# EAGLE design ring_indicator (EAGLE 6.6.0)
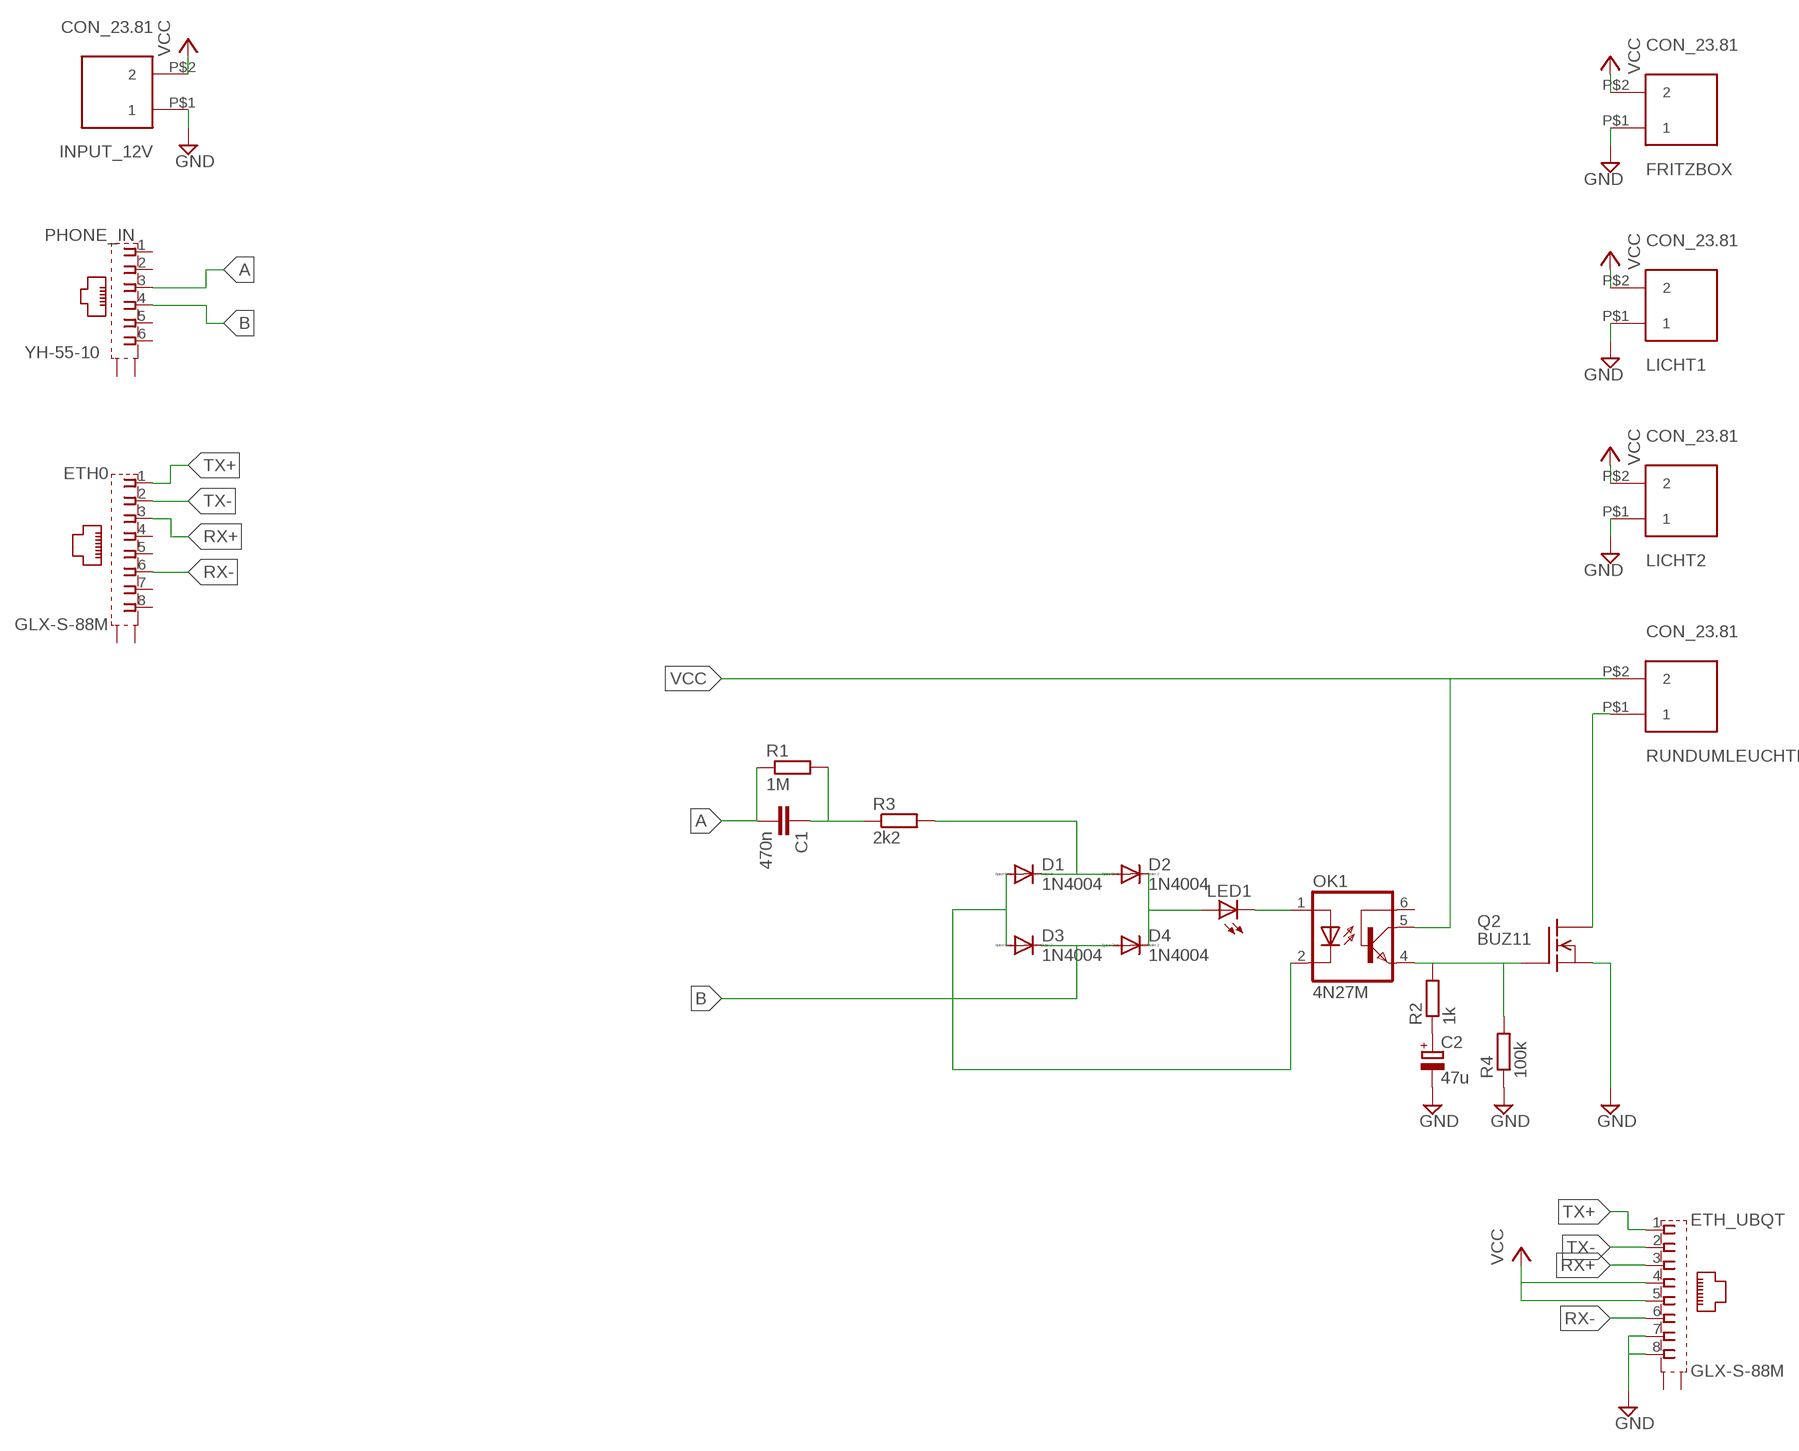
[diagram p0: schematic, sheet 1]

## Parts
C1  470n  C-EU102-064X133  [C102-064X133]
C2  47u  CPOL-EUE3.5-8  [E3,5-8]
D1  1N4004  [DO41-10]
D2  1N4004  [DO41-10]
D3  1N4004  [DO41-10]
D4  1N4004  [DO41-10]
ETH0  GLX-S-88M  [GLX-S-88M]
ETH_UBQT  GLX-S-88M  [GLX-S-88M]
FRITZBOX  CON_23.81  [CON_2_3.81]
INPUT_12V  CON_23.81  [CON_2_3.81]
LED1  LED5MM  [LED5MM]
LICHT1  CON_23.81  [CON_2_3.81]
LICHT2  CON_23.81  [CON_2_3.81]
OK1  4N27M  [DIL06]
PHONE_IN  YH-55-10  [YH-55-10]
Q2  BUZ11  [TO220]
R1  1M  R-EU_0207/10  [0207/10]
R2  1k  R-EU_0207/10  [0207/10]
R3  2k2  R-EU_0207/10  [0207/10]
R4  100k  R-EU_0207/10  [0207/10]
RUNDUMLEUCHTE  CON_23.81  [CON_2_3.81]

## Nets
A: C1.2 PHONE_IN.3 R1.1
B: D3.C D4.A PHONE_IN.4
GND: C2.- ETH_UBQT.7 ETH_UBQT.8 FRITZBOX.P$1 INPUT_12V.P$1 LICHT1.P$1 LICHT2.P$1 Q2.3(S) R4.1
N$1: C1.1 R1.2 R3.1
N$2: LED1.K(C) OK1.1(A)
N$3: D1.C D2.A R3.2
N$4: D2.C D4.C LED1.A
N$5: D1.A D3.A OK1.2(C)
N$6: Q2.2(D) RUNDUMLEUCHTE.P$1
N$9: OK1.4(EMI) Q2.1(G) R2.2 R4.2
N$10: C2.+ R2.1
RX+: ETH0.3 ETH_UBQT.3
RX-: ETH0.6 ETH_UBQT.6
TX+: ETH0.1 ETH_UBQT.1
TX-: ETH0.2 ETH_UBQT.2
VCC: ETH_UBQT.4 ETH_UBQT.5 FRITZBOX.P$2 INPUT_12V.P$2 LICHT1.P$2 LICHT2.P$2 OK1.5(COL) RUNDUMLEUCHTE.P$2
Unconnected: ETH0.4 ETH0.5 ETH0.7 ETH0.8 ETH0.S1 ETH0.S2 ETH_UBQT.S1 ETH_UBQT.S2 OK1.6(BAS) PHONE_IN.1 PHONE_IN.2 PHONE_IN.5 PHONE_IN.6 PHONE_IN.S1(S) PHONE_IN.S2(S)

## Library data of the parts
C1 = resistor:C-EU: CAPACITOR, European symbol
C2 = rcl:CPOL-EU: POLARIZED CAPACITOR, European symbol
D1-D4 = diode:1N4004: DIODE general purpose rectifier, 1 A
ETH0 ETH_UBQT = con-kycon:GLX-S-88M: Mod. Jack, Right Angle, 8 posiotion, 8 contatcs RJ45 Source: GLX-S-88M.pdf; OC_FARNELL: unknown; OC_NEWARK: unknown
FRITZBOX INPUT_12V LICHT1 LICHT2 RUNDUMLEUCHTE = pcaroli:CON_2
LED1 = led:LED: LED OSRAM: - CHIPLED LG R971, LG N971, LY N971, LG Q971, LY Q971, LO R971, LY R971 LH N974, LH R974 LS Q976, LO Q976, LY Q976 LO Q996 - Hyper CHIPLED LW Q18S LB Q993, LB Q99A, LB R99A - SideLED LS A670, LO A670, LY A670, LG A670, LP A670 LB A673, LV A673, LT A673, LW A673 LH A674 LY A675 LS A676, LA A676, LO A676, LY A676, LW A676 LS A679, LY A679, LG A679 - Hyper Micro SIDELED® LS Y876, LA Y876, LO Y876, LY Y876 LT Y87S - SmartLED LW L88C, LW L88S LB L89C, LB L89S, LG L890 LS L89K, LO L89K, LY L89K LS L896, LA L896, LO L896, LY L896 - TOPLED LS T670, LO T670, LY T670, LG T670, LP T670 LSG T670, LSP T670, LSY T670, LOP T670, LYG T670 LG T671, LOG T671, LSG T671 LB T673, LV T673, LT T673, LW T673 LH T674 LS T676, LA T676, LO T676, LY T676, LB T676, LH T676, LSB T676, LW T676 LB T67C, LV T67C, LT T67C, LS T67K, LO T67K, LY T67K, LW E67C LS E67B, LA E67B, LO E67B, LY E67B, LB E67C, LV E67C, LT E67C LW T67C LS T679, LY T679, LG T679 LS T770, LO T770, LY T770, LG T770, LP T770 LB T773, LV T773, LT T773, LW T773 LH T774 LS E675, LA E675, LY E675, LS T675 LS T776, LA T776, LO T776, LY T776, LB T776 LHGB T686 LT T68C, LB T68C - Hyper Mini TOPLED® LB M676 - Mini TOPLED Santana® LG M470 LS M47K, LO M47K, LY M47K Source: http://www.osram.convergy.de LUXEON: - LUMILED® LXK2-PW12-R00, LXK2-PW12-S00, LXK2-PW14-U00, LXK2-PW14-V00 LXK2-PM12-R00, LXK2-PM12-S00, LXK2-PM14-U00 LXK2-PE12-Q00, LXK2-PE12-R00, LXK2-PE12-S00, LXK2-PE14-T00, LXK2-PE14-U00 LXK2-PB12-K00, LXK2-PB12-L00, LXK2-PB12-M00, LXK2-PB14-N00, LXK2-PB14-P00, LXK2-PB14-Q00 LXK2-PR12-L00, LXK2-PR12-M00, LXK2-PR14-Q00, LXK2-PR14-R00 LXK2-PD12-Q00, LXK2-PD12-R00, LXK2-PD12-S00 LXK2-PH12-R00, LXK2-PH12-S00 LXK2-PL12-P00, LXK2-PL12-Q00, LXK2-PL12-R00 Source: www.luxeon.com KINGBRIGHT: KA-3528ASYC Source: www.kingbright.com
OK1 = optocoupler:4N*?M: General Purpose 6-Pin Phototransistor Optocouplers Source: http://www.fairchildsemi.com/ds/4N/4N35-M.pdf; MF: FAIRCHILD SEMICONDUCTOR; MPN: 4N27M; OC_FARNELL: unknown; OC_NEWARK: 72K9939
PHONE_IN = con-wenzhou-yihua:YH-55-10: RJ11 6 connects Source: YH-55-10.pdf; OC_FARNELL: unknown; OC_NEWARK: unknown
Q2 = transistor-fet:BUZ11: N-Channel Enhancement MOSFET 50V; 30A; 0,040Ohm
R1-R4 = rcl:R-EU_: RESISTOR, European symbol

## Board
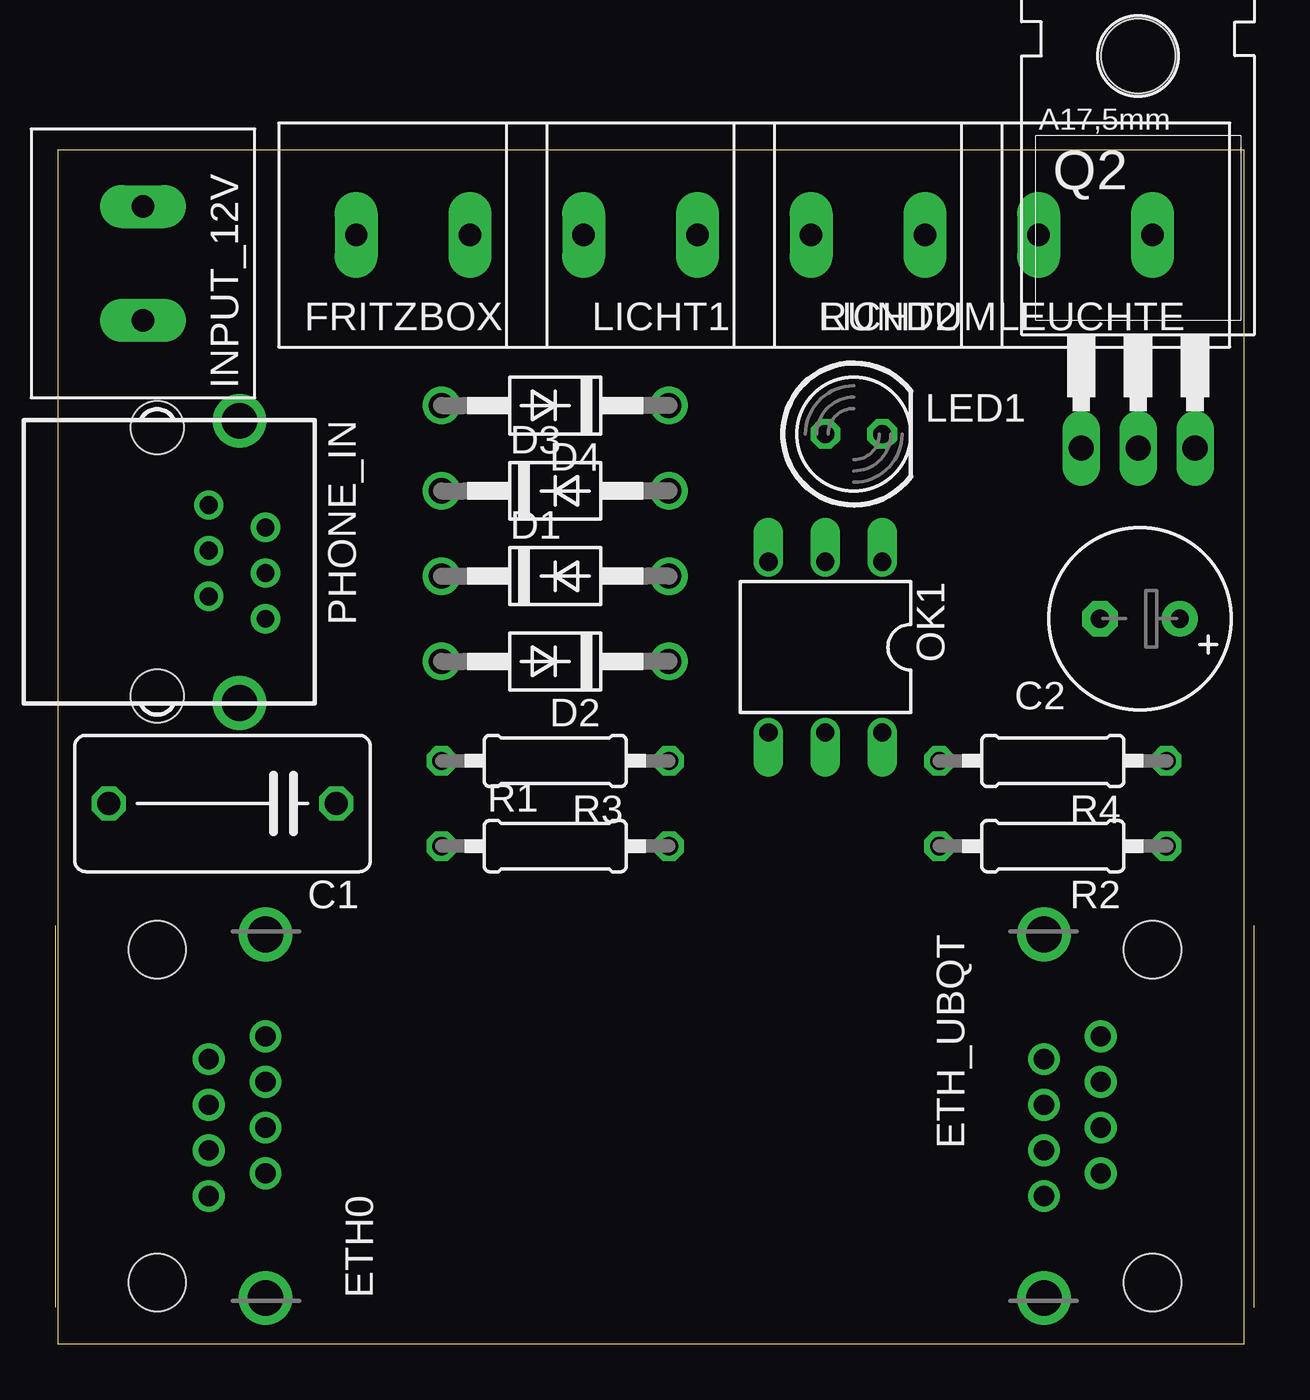
[diagram p1: board, top side]
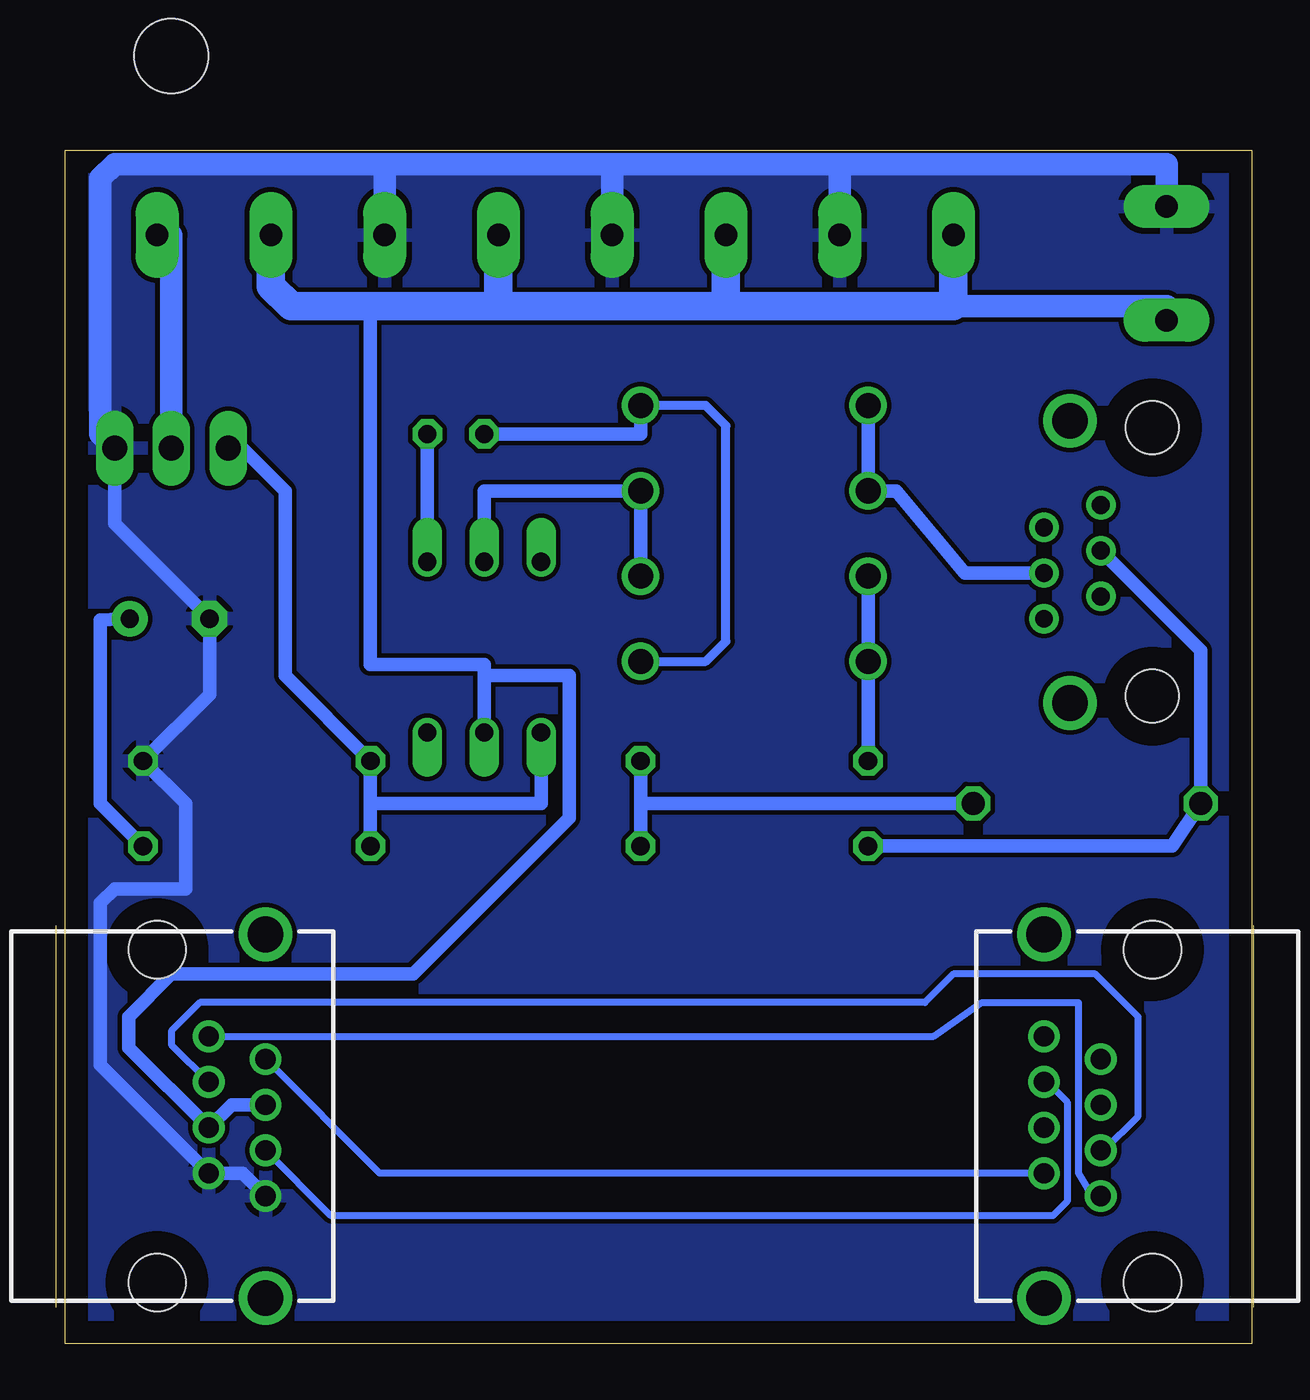
[diagram p2: board, bottom side, seen from below]

Size 53.01 x 53.33 mm. Coordinates in mm from the lower left corner, seen from the top.
Outline: 0,0 53.01,0 53.01,53.33 0,53.33 0,0
Copper layers (1*16): Top 0.035mm / dielectric 1.5mm / Bottom 0.035mm
Design rules "default": minimum track width 10mil, minimum drill 24mil, track to track 8mil, track to pad 8mil, pad to pad 8mil, via to via 8mil, smd to smd 8mil, copper to edge 40mil, drill to drill 8mil, minimum pad ring 10mil, minimum via ring 8mil, stop-mask expansion 4mil, vias tented up to drill 0mil, thermal gap 10mil

### Footprints (pad centres in the part's own frame; a part is rotated, then mirrored left to right if it is on the bottom)
C102-064X133 = drill 1.016 octagon: 1 -5.08,0; 2 5.08,0
E3,5-8 = drill 0.813 pad 1.6: + -1.778,0 | drill 0.813 pad 1.6 octagon: - 1.778,0
DO41-10 = drill 1.118: A 5.08,0; C -5.08,0
GLX-S-88M = drill 0.9 pad 1.422: 1 -3.57,-2.3; 2 -2.55,-4.84; 3 -1.53,-2.3; 4 -0.51,-4.84; 5 0.51,-2.3; 6 1.53,-4.84; 7 2.55,-2.3; 8 3.57,-4.84 | drill 1.6 pad 2.184: S1 -8.125,-4.84; S2 8.125,-4.84 | hole 2.55: -7.44,0; 7.44,0
CON_2_3.81 = drill 1 pad 1.93 long: P$1 -2.54,0; P$2 2.54,0
LED5MM = drill 0.813 octagon: A -1.27,0; K 1.27,0
DIL06 = drill 0.813 offset: 1 -2.54,-3.81; 2 0,-3.81; 3 2.54,-3.81; 4 2.54,3.81; 5 0,3.81; 6 -2.54,3.81
YH-55-10 = drill 0.8 pad 1.3: 1 -2.54,2.3; 2 -1.54,4.84; 3 -0.5,2.3; 4 0.5,4.84; 5 1.54,2.3; 6 2.54,4.84 | drill 1.6 pad 2.184: S1 -6.3,3.68; S2 6.3,3.68 | hole 2.36: -6,0; 6,0
TO220 = drill 1.118 long: 1 -2.54,-6.35; 2 0,-6.35; 3 2.54,-6.35 | hole 3.302: 0,11.176
0207/10 = drill 0.813 octagon: 1 -5.08,0; 2 5.08,0

### Placement (x,y rotation side)
C1  7.37,24.13 180 top
C2  48.34,32.38 180 top
D1  22.23,34.29 0 top
D2  22.23,30.48 180 top
D3  22.23,38.1 0 top
D4  22.23,41.91 180 top
ETH0  4.45,10.16 90 top
ETH_UBQT  48.9,10.16 270 top
FRITZBOX  15.88,49.53 180 top
INPUT_12V  3.81,48.26 270 top
LED1  35.56,40.64 0 top
LICHT1  26.04,49.53 180 top
LICHT2  36.2,49.53 180 top
OK1  34.29,31.11 180 top
PHONE_IN  4.45,34.92 270 top
Q2  48.26,46.35 0 top
R1  22.23,22.23 0 top
R2  44.45,22.23 180 top
R3  22.23,26.04 180 top
R4  44.45,26.04 180 top
RUNDUMLEUCHTE  46.35,49.53 180 top

### Tracks (layer width: path | path; a pad name or v marks a point on that pad's centre or on a via)
A
  Bottom 0.61: R1.1 3.56,22.23 C1.2 2.29,30.97 PHONE_IN.3
B
  Bottom 0.61: D4.A D3.C 15.88,38.1 12.84,34.42 PHONE_IN.4
GND
  Bottom 0.61: Q2.3 50.8,36.63 C2.- 46.56,29.01 R4.1 47.62,24.13 47.62,20.32 50.8,20.32 51.44,19.68 51.44,12.45 ETH_UBQT.7 45.08,7.61 ETH_UBQT.8
  Bottom 1.016: FRITZBOX.P$1 18.41,52.7 | 18.41,52.7 3.81,52.7 INPUT_12V.P$1 | LICHT1.P$1 28.57,52.7 | 28.57,52.7 18.41,52.7 | LICHT2.P$1 38.73,52.7 | 38.73,52.7 28.57,52.7 | 38.73,52.7 50.8,52.7 51.44,52.07 51.44,40.64 Q2.3
  pour Bottom: 0,53.34 52.7,53.34 52.7,0 0,0
N$1
  Bottom 0.61: R3.1 27.3,24.13 | 27.3,24.13 R1.2 | C1.1 27.3,24.13
N$2
  Bottom 0.61: LED1.K OK1.1
N$3
  Bottom 0.61: D1.C D2.A R3.2
N$4
  Bottom 0.406: D2.C 24.39,30.48 23.5,31.38 23.5,41.01 24.39,41.91 D4.C
  Bottom 0.61: D4.C 27.3,40.64 LED1.A
N$5
  Bottom 0.61: D1.A D3.A 34.29,38.1 OK1.2
N$6
  Bottom 1.016: Q2.2 48.26,49.53 RUNDUMLEUCHTE.P$1
N$9
  Bottom 0.61: OK1.4 31.75,24.13 39.37,24.13 | 39.37,24.13 R2.2 | 39.37,24.13 R4.2 43.18,29.84 43.18,38.1 45.09,40.01 Q2.1
N$10
  Bottom 0.61: C2.+ 51.44,32.33 51.44,24.13 R2.1
RX+
  Bottom 0.305: ETH0.3 6.61,8.63 5.08,10.16 5.08,14.61 6.99,16.51 13.34,16.51 14.61,15.24 46.99,15.24 48.26,13.97 48.26,13.36 ETH_UBQT.3
RX-
  Bottom 0.305: ETH0.6 9.15,11.69 8.26,10.79 8.26,6.35 8.89,5.71 41.14,5.71 ETH_UBQT.6
TX+
  Bottom 0.305: ETH_UBQT.1 14.21,13.73 12.06,15.24 7.75,15.24 7.75,7.62 6.99,6.35 ETH0.1
TX-
  Bottom 0.305: ETH0.2 38.95,7.61 ETH_UBQT.2
VCC
  Bottom 0.61: 39.37,46.35 39.37,30.33 34.29,30.33 OK1.5 34.29,29.84 30.48,29.84 30.48,23.5 37.47,16.51 48.26,16.51 50.16,14.61 50.16,13.22 ETH_UBQT.5 45.58,10.67 ETH_UBQT.4
  Bottom 1.016: INPUT_12V.P$2 3.81,46.35 13.34,46.35
  Bottom 1.27: FRITZBOX.P$2 13.34,46.35 23.5,46.35 | 23.5,46.35 LICHT1.P$2 | 23.5,46.35 33.66,46.35 | 33.66,46.35 LICHT2.P$2 | 33.66,46.35 39.37,46.35 42.92,46.35 43.81,47.25 RUNDUMLEUCHTE.P$2